# EAGLE design ESP32DevKitCv4_SA8x8_Ver_B (EAGLE 9.6.2)
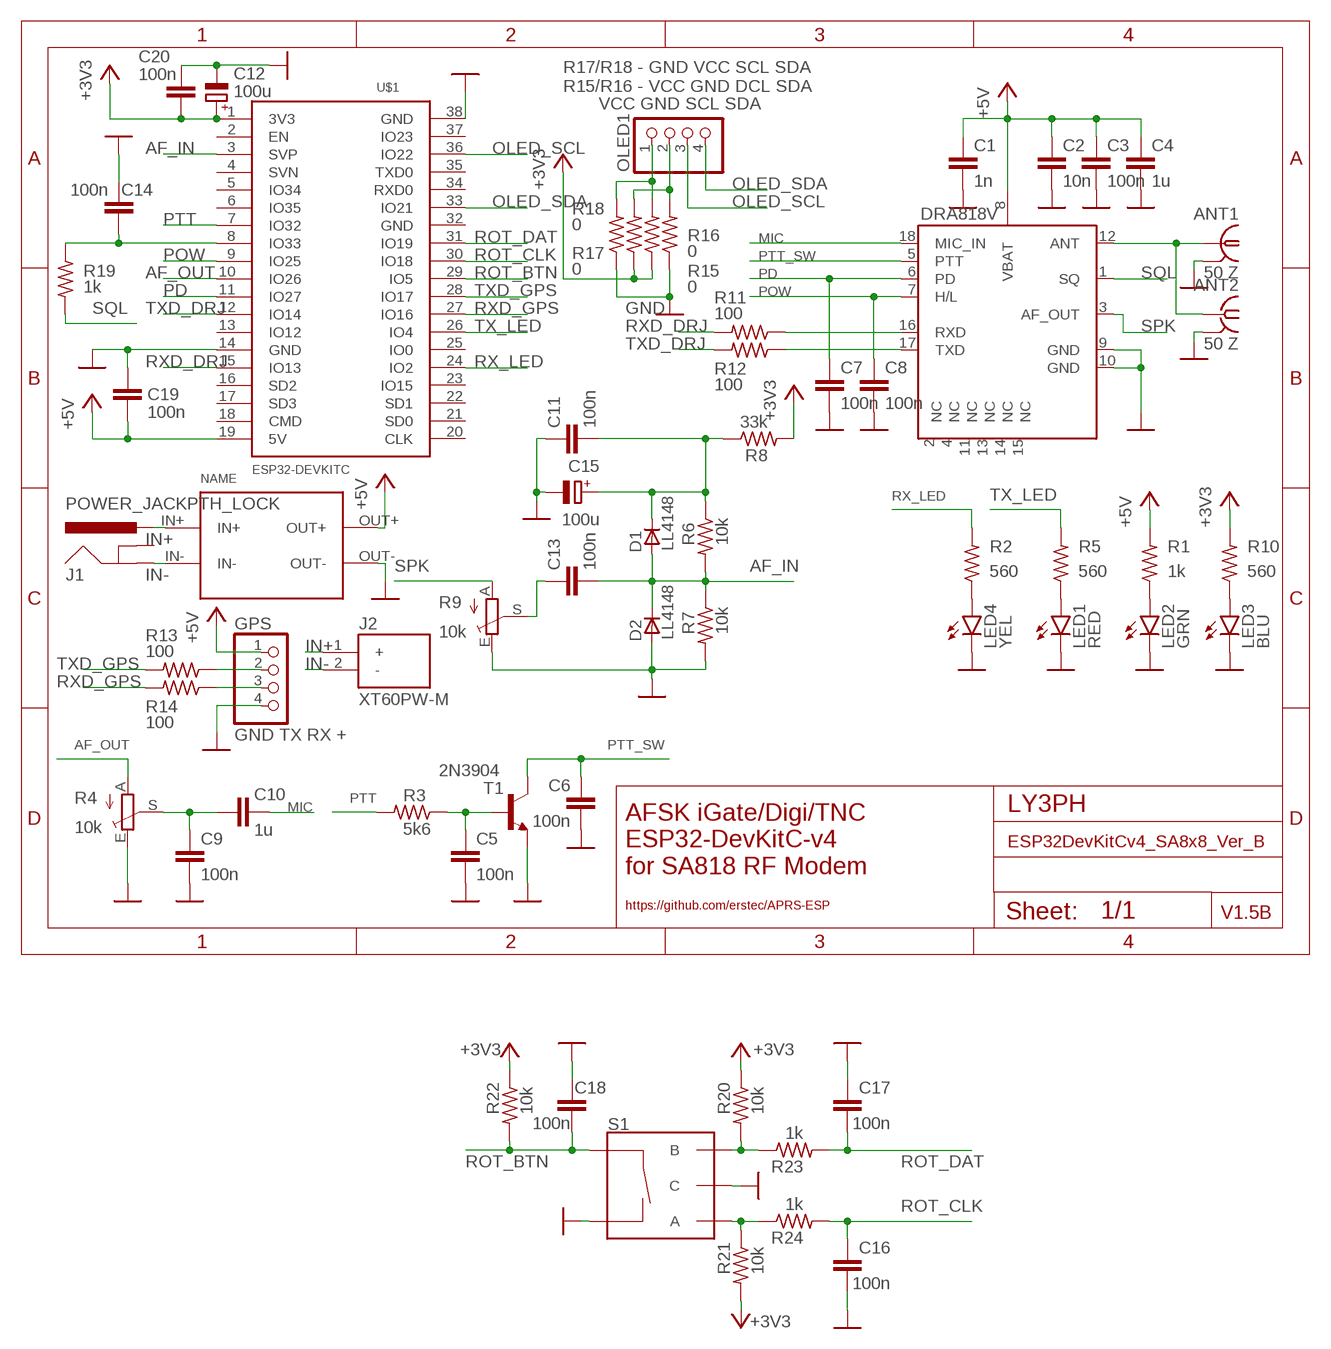
[diagram p0: schematic, sheet 1]

## Parts
ANT1  50 Z  LTI-SASF54GT  [LTI-SASF54GT]
ANT2  50 Z  SMA-142-0701-801/806  [J502-ND-142-0701-801/806]
C1  1n  C-EUC0805  [C0805]
C2  10n  C-EUC0805  [C0805]
C3  100n  C-EUC0805  [C0805]
C4  1u  C-EUC0805  [C0805]
C5  100n  C-EUC0805  [C0805]
C6  100n  C-EUC0805  [C0805]
C7  100n  C-EUC0805  [C0805]
C8  100n  C-EUC0805  [C0805]
C9  100n  C-EUC0805  [C0805]
C10  1u  C-EUC0805  [C0805]
C11  100n  C-EUC0805  [C0805]
C12  100u  CPOL-EUSMCD  [SMC_D]
C13  100n  C-EUC0805  [C0805]
C14  100n  C-EUC0805  [C0805]
C15  100u  CPOL-EUSMCD  [SMC_D]
C16  100n  C-EUC0805  [C0805]
C17  100n  C-EUC0805  [C0805]
C18  100n  C-EUC0805  [C0805]
C19  100n  C-EUC0805  [C0805]
C20  100n  C-EUC0805  [C0805]
D1  LL4148  [SOD80_DO213AA_MINIMELF]
D2  LL4148  [SOD80_DO213AA_MINIMELF]
DRA818V  DRA818A  [DRA818A]
GPS  GND TX RX +  PINHD-1X4  [1X04]
J1  POWER_JACKPTH_LOCK  [POWER_JACK_PTH_LOCK]
J2  XT60PW-M  [AMASS_XT60PW-M]
LED1  RED  LEDCHIP-LED0805  [CHIP-LED0805]
LED2  GRN  LEDCHIP-LED0805  [CHIP-LED0805]
LED3  BLU  LEDCHIP-LED0805  [CHIP-LED0805]
LED4  YEL  LEDCHIP-LED0805  [CHIP-LED0805]
OLED1  VCC GND SCL SDA  PINHD-1X4  [1X04]
R1  1k  R-US_R0805  [R0805]
R2  560  R-US_R0805  [R0805]
R3  5k6  R-US_R0805  [R0805]
R4  10k  TRIM_EU-CA6H  [CA6H]
R5  560  R-US_R0805  [R0805]
R6  10k  R-US_R0805  [R0805]
R7  10k  R-US_R0805  [R0805]
R8  33k  R-US_R0805  [R0805]
R9  10k  TRIM_EU-CA6H  [CA6H]
R10  560  R-US_R0805  [R0805]
R11  100  R-US_R0805  [R0805]
R12  100  R-US_R0805  [R0805]
R13  100  R-US_R0805  [R0805]
R14  100  R-US_R0805  [R0805]
R15  0  R-US_R0805  [R0805]
R16  0  R-US_R0805  [R0805]
R17  0  R-US_R0805  [R0805]
R18  0  R-US_R0805  [R0805]
R19  1k  R-US_R0805  [R0805]
R20  10k  R-US_R0805  [R0805]
R21  10k  R-US_R0805  [R0805]
R22  10k  R-US_R0805  [R0805]
R23  1k  R-US_R0805  [R0805]
R24  1k  R-US_R0805  [R0805]
S1  ENCODER-SWITCH  [ROTARY_ENC_PLAIN]
T1  2N3904  MMBT3904LT1-NPN-SOT23-BEC  [SOT23-BEC]
U$1  ESP32DEVKITC  [ESP32-DEVKITC]
U$2  CP8-ADJ  [CP8-ADJ]

## Nets
+3V3: C12.+ C20.2 R8.2 R10.2 R15.1 R17.1 R20.1 R21.2 R22.1 U$1.1(3V3)
+5V: C1.1 C2.1 C3.1 C4.1 C19.2 DRA818V.8(VBAT) GPS.1 R1.2 U$1.19(5V) U$2.OUT+
AF_IN: C13.2 D1.A D2.C R6.2 R7.1 U$1.3(SVP)
AF_OUT: R4.A U$1.10(IO26)
GND: ANT1.2 ANT1.3 ANT1.4 ANT1.5 ANT2.G@1 ANT2.G@2 ANT2.G@3 ANT2.G@4 C1.2 C2.2 C3.2 C4.2 C5.2 C6.2 C7.2 C8.2 C9.2 C11.1 C12.- C14.2 C15.- C16.2 C17.1 C18.1 C19.1 C20.1 D2.A DRA818V.9(GND) DRA818V.10(GND) GPS.4 LED1.C LED2.C LED3.C LED4.C R4.E R7.2 R9.E R16.1 R18.1 S1.C S1.SW- T1.E U$1.14(GND) U$1.38(GND) U$2.OUT-
IN+: J1.PWR J2.1(+) U$2.IN+
IN-: J1.GND J2.2(-) U$2.IN-
MIC: C10.2 DRA818V.18(MIC_IN)
N$1: LED1.A R5.1
N$2: C11.2 C15.+ D1.C R6.1 R8.1
N$3: GPS.2 R13.1
N$4: C13.1 R9.S
N$5: ANT1.1 ANT2.1 DRA818V.12(ANT)
N$7: C5.1 R3.1 T1.B
N$8: LED4.A R2.1
N$9: C9.1 C10.1 R4.S
N$12: LED3.A R10.1
N$13: GPS.3 R14.1
N$14: DRA818V.16(RXD) R11.1
N$15: DRA818V.17(TXD) R12.1
N$16: OLED1.2 R16.2 R17.2
N$17: OLED1.1 R15.2 R18.2
N$18: C14.1 R19.1 U$1.8(IO33)
N$41: LED2.A R1.1
OLED_SCL: OLED1.3 U$1.36(IO22)
OLED_SDA: OLED1.4 U$1.33(IO21)
PD: C7.1 DRA818V.6(PD) U$1.11(IO27)
POW: C8.1 DRA818V.7(H/L) U$1.9(IO25)
PTT: R3.2 U$1.7(IO32)
PTT_SW: C6.1 DRA818V.5(PTT) T1.C
ROT_BTN: C18.2 R22.2 S1.SW+ U$1.29(IO5)
ROT_CLK: C16.1 R24.2 U$1.30(IO18)
ROT_CLK_ROUTE: R21.1 R24.1 S1.A
ROT_DAT: C17.2 R23.2 U$1.31(IO19)
ROT_DAT_ROUTE: R20.2 R23.1 S1.B
RX_LED: R2.2 U$1.24(IO2)
RXD_DRJ: R11.2 U$1.15(IO13)
RXD_GPS: R14.2 U$1.27(IO16)
SPK: DRA818V.3(AF_OUT) R9.A
SQL: DRA818V.1(SQ) R19.2
TX_LED: R5.2 U$1.26(IO4)
TXD_DRJ: R12.2 U$1.12(IO14)
TXD_GPS: R13.2 U$1.28(IO17)
Unconnected: DRA818V.2(NC) DRA818V.4(NC) DRA818V.11(NC) DRA818V.13(NC) DRA818V.14(NC) DRA818V.15(NC) J1.GNDBREAK U$1.2(EN) U$1.4(SVN) U$1.5(IO34) U$1.6(IO35) U$1.13(IO12) U$1.16(SD2) U$1.17(SD3) U$1.18(CMD) U$1.20(CLK) U$1.21(SD0) U$1.22(SD1) U$1.23(IO15) U$1.25(IO0) U$1.32(GND) U$1.34(RXD0) U$1.35(TXD0) U$1.37(IO23)

## Notes on the sheet
- R17/R18 - GND VCC SCL SDA
  R15/R16 - VCC GND DCL SDA
- LY3PH
- AFSK iGate/Digi/TNC
  ESP32-DevKitC-v4
  for SA818 RF Modem
- https://github.com/erstec/APRS-ESP
- V1.5B

## Library data of the parts
ANT1 = con-coax:LTI-SASF54GT: SMA vertical PCB thrue hole jack Source: Lighthorse Technologies, inc. SASF54GT.pdf; OC_FARNELL: unknown; OC_NEWARK: unknown
ANT2 = con-coax:SMA-: SMA 50 Ohm End Launch Jack Receptacle - Round Contact Johnson Components Source: www.johnsoncomponents.com .. J502-ND.pdf; MF: JOHNSON COMPONENTS; MPN: 142-0701-801; OC_FARNELL: 1608592; OC_NEWARK: 90F2624
C1-C11 C13 C14 C16-C20 = resistor:C-EU: CAPACITOR, European symbol
C12 C15 = rcl:CPOL-EU: POLARIZED CAPACITOR, European symbol; SPICEPREFIX: C
D1 D2 = _hhn_diodes_smd:LL4148: 1N4148 General Purpose Rectifie SMD-Version of 1N4148 Case: SOD 80 = DO 213 AA = MINIMELF (Glass) Author: Dipl.-Ing. FH Rainer Bayer HHN Hochschule Heilbronn, rainer.bayer@hs-heilbronn.de Ingenieurbüro ing-rb, mail@ing-rb.de
DRA818V = dorji:DRA818A
GPS OLED1 = pinhead:PINHD-1X4: PIN HEADER
J1 = SparkFun-Connectors:POWER_JACK: Power Jack Connector This is the standard 5.5mm barrel jack for power. The PTH is the most common, proven, reliable, footprint. The Slot footprint only works if the mill layer is transmitted to the PCB fab house so be warned. Here are the connectors we sell at SparkFun: DC Barrel Power Jack/Connector <https://www.sparkfun.com/products/119> (PRT-00119) DC Barrel Power Jack/Connector (SMD) <https://www.sparkfun.com/products/12748> (PRT-12748) DC Barrel Jack Adapter - Breadboard Compatible <https://www.sparkfun.com/products/10811> (PRT-10811) It is used on this SparkFun product (and many, many others): SparkFun RedBoard - Programmed with Arduino <https://www.sparkfun.com/products/12757> (DEV-12757) Also, if you need a mating power supply or connector, please check these out: Wall Adapter Power Supply - 9VDC 650mA <https://www.sparkfun.com/products/298> (TOL-00298) DC Barrel Jack Adapter - Male <https://www.sparkfun.com/products/10287> (PRT-10287); PROD_ID: CONN-08197; SF_ID: PRT-00119
J2 = XT60PW-M:XT60PW-M: Check availability <https://pricing.snapeda.com/parts/XT60PW-M/AMASS/view-part?ref=eda>; AVAILABILITY: Not in stock; DESCRIPTION: Socket, DC supply, male, PIN: 2; MF: AMASS; MP: XT60PW-M; PACKAGE: Package; PRICE: None
LED1-LED4 = led:LED: LED OSRAM: - CHIPLED LG R971, LG N971, LY N971, LG Q971, LY Q971, LO R971, LY R971 LH N974, LH R974 LS Q976, LO Q976, LY Q976 LO Q996 - Hyper CHIPLED LW Q18S LB Q993, LB Q99A, LB R99A - SideLED LS A670, LO A670, LY A670, LG A670, LP A670 LB A673, LV A673, LT A673, LW A673 LH A674 LY A675 LS A676, LA A676, LO A676, LY A676, LW A676 LS A679, LY A679, LG A679 - Hyper Micro SIDELED® LS Y876, LA Y876, LO Y876, LY Y876 LT Y87S - SmartLED LW L88C, LW L88S LB L89C, LB L89S, LG L890 LS L89K, LO L89K, LY L89K LS L896, LA L896, LO L896, LY L896 - TOPLED LS T670, LO T670, LY T670, LG T670, LP T670 LSG T670, LSP T670, LSY T670, LOP T670, LYG T670 LG T671, LOG T671, LSG T671 LB T673, LV T673, LT T673, LW T673 LH T674 LS T676, LA T676, LO T676, LY T676, LB T676, LH T676, LSB T676, LW T676 LB T67C, LV T67C, LT T67C, LS T67K, LO T67K, LY T67K, LW E67C LS E67B, LA E67B, LO E67B, LY E67B, LB E67C, LV E67C, LT E67C LW T67C LS T679, LY T679, LG T679 LS T770, LO T770, LY T770, LG T770, LP T770 LB T773, LV T773, LT T773, LW T773 LH T774 LS E675, LA E675, LY E675, LS T675 LS T776, LA T776, LO T776, LY T776, LB T776 LHGB T686 LT T68C, LB T68C - Hyper Mini TOPLED® LB M676 - Mini TOPLED Santana® LG M470 LS M47K, LO M47K, LY M47K Source: http://www.osram.convergy.de LUXEON: - LUMILED® LXK2-PW12-R00, LXK2-PW12-S00, LXK2-PW14-U00, LXK2-PW14-V00 LXK2-PM12-R00, LXK2-PM12-S00, LXK2-PM14-U00 LXK2-PE12-Q00, LXK2-PE12-R00, LXK2-PE12-S00, LXK2-PE14-T00, LXK2-PE14-U00 LXK2-PB12-K00, LXK2-PB12-L00, LXK2-PB12-M00, LXK2-PB14-N00, LXK2-PB14-P00, LXK2-PB14-Q00 LXK2-PR12-L00, LXK2-PR12-M00, LXK2-PR14-Q00, LXK2-PR14-R00 LXK2-PD12-Q00, LXK2-PD12-R00, LXK2-PD12-S00 LXK2-PH12-R00, LXK2-PH12-S00 LXK2-PL12-P00, LXK2-PL12-Q00, LXK2-PL12-R00 Source: www.luxeon.com KINGBRIGHT: KA-3528ASYC Source: www.kingbright.com
R1-R3 R5-R8 R10-R24 = resistor:R-US_: RESISTOR, American symbol
R4 R9 = pot:TRIM_EU-: POTENTIOMETER
S1 = SparkFun-Switches:ENCODER-SWITCH: Rotary Encoder w/ Select Switch Encoders rotate similarly to potentiometers, but they’re different from potentiometers in that an encoder has full rotation without limits. They output gray code so that you can tell how much and in which direction the encoder has been turned. This encoder includes a push-down select switch built into the shaft. SparkFun Products Rotary Encoder <https://www.sparkfun.com/products/9117> (COM-09117); SF_SKU: COM-09117
T1 = transistor:*-NPN-: NPN Transistror BF959 corrected 2008.03.06
U$1 = ESP32-DEVKITC:ESP32DEVKITC
U$2 = userlib:CP8-ADJ: Voltage regulator IN: 7-35V OUT: ADJ

## Board
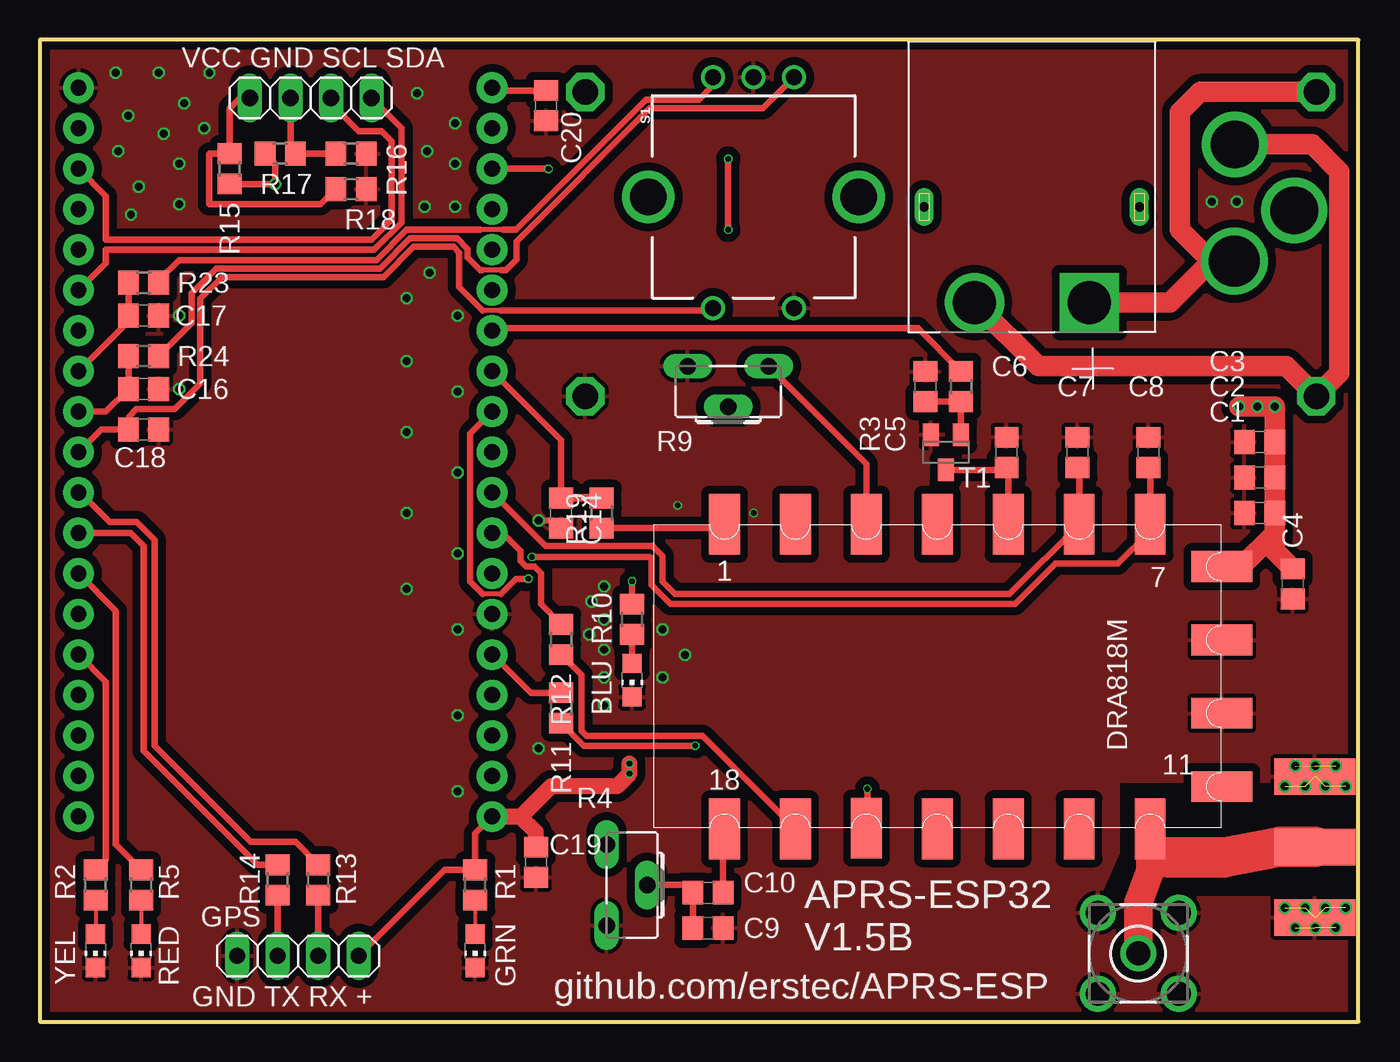
[diagram p1: board, top side]
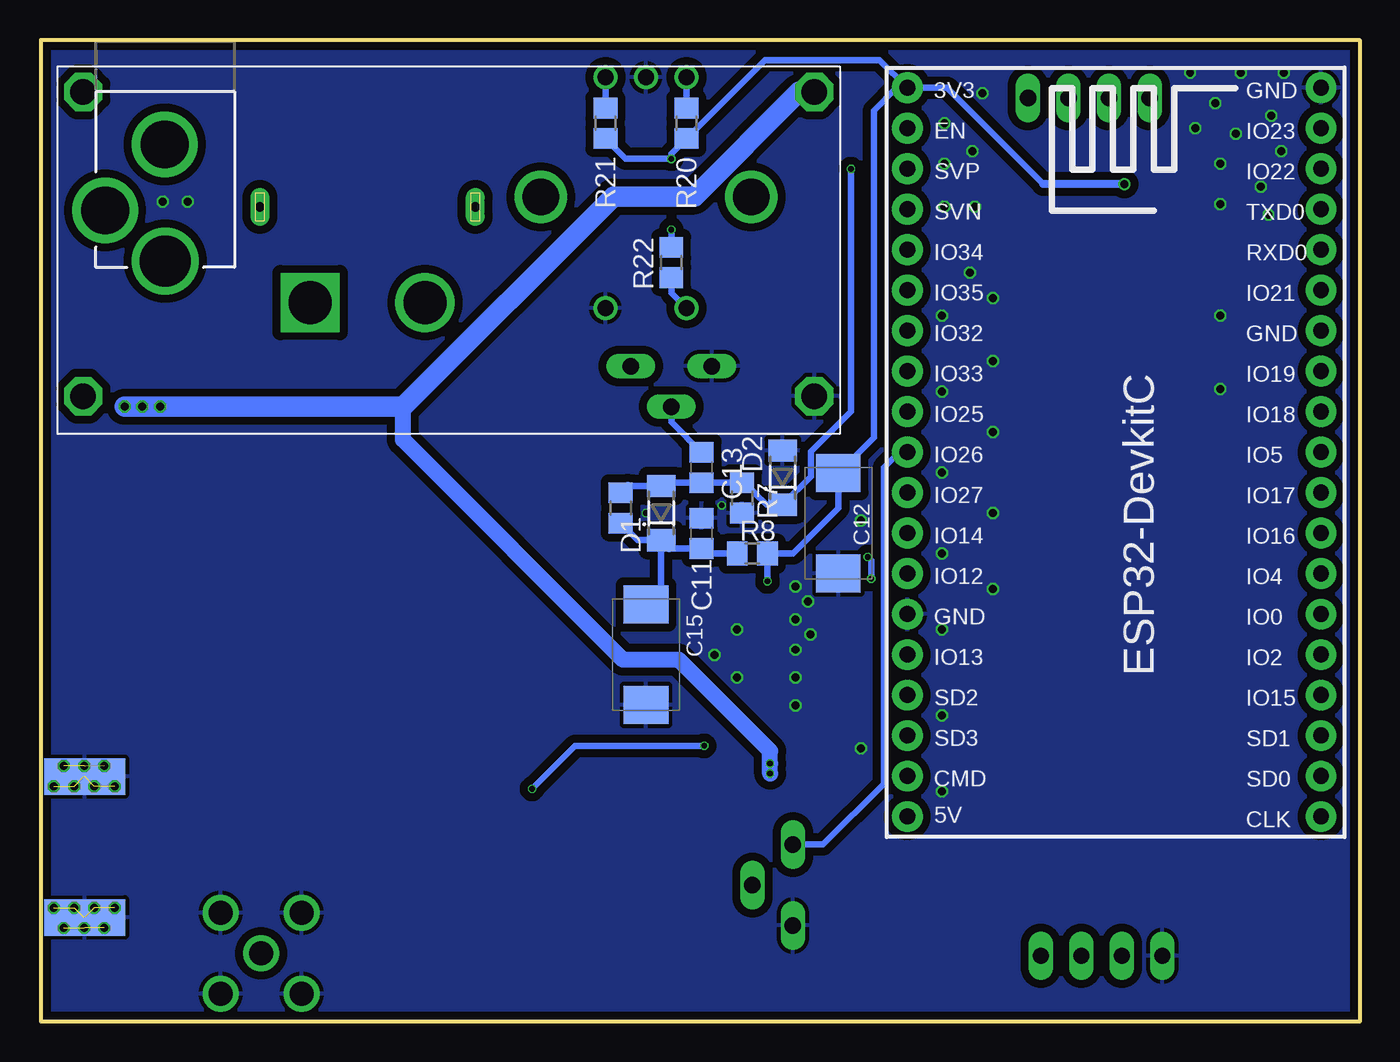
[diagram p2: board, bottom side, seen from below]

Size 82.71 x 61.59 mm. Coordinates in mm from the lower left corner, seen from the top.
Outline: 0,61.6 0,0 82.71,0 82.71,61.6 0,61.6
Copper layers (1*16): Top 0.035559375mm / dielectric 1.6mm / Bottom 0.035559375mm
Design rules "jlcpcb-2layers *": minimum track width 5mil, minimum drill 12mil, track to track 5mil, track to pad 5mil, pad to pad 5mil, via to via 5mil, smd to smd 5mil, copper to edge 8mil, drill to drill 6mil, minimum pad ring 5mil, minimum via ring 3mil, stop-mask expansion 2.5mil, vias tented up to drill 100mil, thermal gap 10mil

### Footprints (pad centres in the part's own frame; a part is rotated, then mirrored left to right if it is on the bottom)
LTI-SASF54GT = drill 1.5 pad 2.2: 1 0,0; 2 -2.54,2.54; 3 2.54,2.54; 4 2.54,-2.54; 5 -2.54,-2.54
J502-ND-142-0701-801/806 = smd 5.08 x 2.286: 1 2.565,0; G@1 2.565,4.42; G@2 2.565,-4.42 | smd 5.08 x 2.286 bottom: G@3 2.565,4.42; G@4 2.565,-4.42
C0805 = smd 1.3 x 1.5: 1 -0.95,0; 2 0.95,0
SMC_D = smd 2.4 x 2.8: + -3.15,0; - 3.15,0
SOD80_DO213AA_MINIMELF = smd 1.4 x 1.8: A 1.7,0; C -1.7,0
DRA818A = smd 3.81 x 1.93: 1 -9.45,-13.25; 2 -9.45,-8.8; 3 -9.45,-4.35; 4 -9.45,0.1; 5 -9.45,4.55; 6 -9.45,9; 7 -9.45,13.45; 12 9.65,13.45; 13 9.65,9; 14 9.65,4.55; 15 9.65,0.1; 16 9.6,-4.35; 17 9.65,-8.8; 18 9.65,-13.25 | smd 1.93 x 3.81: 8 -6.8,17.95; 9 -2.2,17.95; 10 2.4,17.95; 11 7,17.95
1X04 = drill 1.016 long: 1 -3.81,0; 2 -1.27,0; 3 1.27,0; 4 3.81,0
POWER_JACK_PTH_LOCK = drill 2.997 pad 4.115: GND 0.025,6.557; GNDBREAK 3.762,10.7 | drill 3.2 pad 4.115: PWR 0,13.878
AMASS_XT60PW-M = drill 2.7 square: 1 3.6,-6 | drill 2.7: 2 -3.6,-6 | drill 0.6 pad 1.2 long: S1 6.75,0; S2 -6.75,0
CHIP-LED0805 = smd 1.2 x 1.2: A 0,-1.05; C 0,1.05
R0805 = smd 1.3 x 1.5: 1 -0.95,0; 2 0.95,0
CA6H = drill 1.016 long: A -2.54,0; E 2.54,0; S 0,2.54
ROTARY_ENC_PLAIN = drill 1.016: A 7.493,-2.54; B 7.493,2.54; C 7.493,0; SW+ -6.985,2.54; SW- -6.985,-2.54 | drill 2.286: P$3 0,6.604; P$4 0,-6.604
SOT23-BEC = smd 1 x 1.4: B -0.95,-1.1; C 0,1.1; E 0.95,-1.1
ESP32-DEVKITC = drill 1 pad 1.93: 1 -22.87,-14.722; 2 -20.33,-14.722; 3 -17.79,-14.722; 4 -15.25,-14.722; 5 -12.71,-14.722; 6 -10.17,-14.722; 7 -7.63,-14.722; 8 -5.09,-14.722; 9 -2.55,-14.722; 10 -0.01,-14.722; 11 2.53,-14.722; 12 5.07,-14.722; 13 7.61,-14.722; 14 10.15,-14.722; 15 12.69,-14.722; 16 15.23,-14.722; 17 17.77,-14.722; 18 20.31,-14.722; 19 22.85,-14.722; 20 22.85,11.23; 21 20.31,11.23; 22 17.77,11.23; 23 15.23,11.23; 24 12.69,11.23; 25 10.15,11.23; 26 7.61,11.23; 27 5.07,11.23; 28 2.53,11.23; 29 -0.01,11.23; 30 -2.55,11.23; 31 -5.09,11.23; 32 -7.63,11.23; 33 -10.17,11.23; 34 -12.71,11.23; 35 -15.25,11.23; 36 -17.79,11.23; 37 -20.33,11.23; 38 -22.87,11.23
CP8-ADJ = drill 1.6 octagon: IN+ -21.81,7.05; IN- -21.81,-12.036; OUT+ 24.054,7.05; OUT- 24.054,-12.036

### Placement (x,y rotation side)
ANT1  68.9,4.29 0 top
ANT2  82.55,10.95 180 top
C1  76.52,31.91 180 top
C2  76.52,34.13 180 top
C3  76.52,36.35 180 top
C4  78.58,27.46 270 top
C5  55.56,39.85 90 top
C6  60.64,35.72 90 top
C7  65.09,35.72 90 top
C8  69.53,35.72 90 top
C9  41.91,5.87 0 top
C10  41.91,8.1 0 top
C11  41.27,30.64 270 bottom
C12  32.7,31.27 270 bottom
C13  41.27,34.77 270 bottom
C14  32.7,31.91 270 top
C15  44.77,23.02 270 bottom
C16  6.51,39.69 0 top
C17  6.51,44.29 180 top
C18  6.51,37.15 180 top
C19  31.12,10 90 top
C20  31.75,57.47 90 top
D1  43.81,31.91 90 bottom
D2  36.2,34.13 90 bottom
DRA818V  56.2,21.75 270 top
GPS  16.19,4.13 180 top
J1  74.93,61.59 180 bottom
J2  62.23,51.12 0 top
LED1  6.35,4.44 180 top
LED2  27.3,4.44 180 top
LED3  37.15,21.43 180 top
LED4  3.49,4.44 180 top
OLED1  16.99,57.94 0 top
R1  27.3,8.57 90 top
R2  3.49,8.57 90 top
R3  57.78,39.85 90 top
R4  35.56,8.57 270 top
R5  6.35,8.57 90 top
R6  46.35,32.23 90 bottom
R7  38.73,32.86 270 bottom
R8  38.1,29.37 0 bottom
R9  43.18,41.12 180 top
R10  37.15,25.24 90 top
R11  32.7,19.68 90 top
R12  32.7,23.97 90 top
R13  17.46,8.89 90 top
R14  14.92,8.89 90 top
R15  11.91,53.5 90 top
R16  19.53,54.45 180 top
R17  15.08,54.45 0 top
R18  19.53,52.23 180 top
R19  35.24,31.91 270 top
R20  42.23,56.36 90 bottom
R21  47.31,56.36 270 bottom
R22  43.18,47.62 270 bottom
R23  6.51,46.36 180 top
R24  6.51,41.75 180 top
S1  44.77,51.75 90 top
T1  56.83,35.72 180 top
U$1  13.65,35.72 270 bottom
U$2  58.26,51.28 0 bottom

### Tracks (layer width: path | path; a pad name or v marks a point on that pad's centre or on a via)
+3V3  (via drill 0.35, 0.51)
  Top 0.406: R17.1 14.76,53.82 v14.76,52.55 | R15.1 v14.76,52.55 | R10.2 v37.15,27.62 | v43.18,49.69 v43.18,54.13 | C20.2 28.55,58.42 U$1.1
  Top 0.508: R10.2 | v14.76,52.55
  Bottom 0.406: v37.15,27.62 R8.2 35.56,29.37 32.7,32.23 C12.+ 30.48,36.65 30.48,57.15 29.04,58.59 U$1.1 | R22.1 v43.18,49.69 | R21.2 46.03,54.13 v43.18,54.13 43.18,54.45 R20.1 37.31,60.33 30.11,60.33 U$1.1 | U$1.1 25.89,58.59 19.84,52.55
  Bottom 0.508: v14.76,52.55 19.84,52.55
+5V  (via drill 0.35, 0.5)
  Top 0.406: U$1.19 27.3,11.8 R1.2 25.4,9.52 GPS.1
  Top 1.016: 30.16,12.86 32.07,14.76 36.2,14.76 v36.99,15.56 v36.99,16.19 | 30.16,12.86 28.38,12.86 U$1.19 | C19.2 31.12,11.91 30.16,12.86
  Top 1.27: 77.47,30.64 C1.1 C2.1 C3.1 v77.47,38.58 v76.36,38.58 v75.25,38.58 | 77.47,30.64 75.38,28.55 DRA818V.8 | C4.1 77.47,29.53 77.47,30.64
  Bottom 1.016: v36.99,15.56 v36.99,16.19 36.99,16.99 42.7,22.7 46.2,22.7 60.01,36.51 60.01,38.58
  Bottom 1.27: v77.47,38.58 60.01,38.58 46.81,51.77 41.73,51.77 35.18,58.33 U$2.OUT+
AF_IN  (via drill 0.35)
  Top 0.406: v31.91,53.5 28.38,53.5 U$1.3
  Bottom 0.406: C13.2 R7.1 38.58,33.81 37.94,33.18 37.95,33.18 37.21,32.43 D2.C 34.43,34.19 34.43,35.76 31.91,38.28 v31.91,53.5 | C13.2 43.61,33.82 | D1.A 45.92,33.61
  Bottom 0.508: C13.2 | 43.61,33.82 D1.A | 45.92,33.61 R6.2
AF_OUT
  Bottom 0.406: R4.A 33.65,11.11 29.85,14.92 29.85,34.77 28.88,35.73 U$1.10
GND  (via drill 0.35, 0.5 pad 0.61)  (12 unrouted)
  Top 0.406: v31.27,31.43 32.23,31.43 C14.2
  Top 0.508: 79.98,16.01 v80.01,16.03 | ANT2.G@4 80.04,15.37 | 79.98,5.9 v80.01,5.87 | ANT2.G@3 80.04,6.53
  other vias: 78.74,16.03 81.28,16.03 78.11,14.76 79.38,14.76 80.65,14.76 78.11,7.14 78.74,5.87 79.38,7.14 80.65,7.14 81.28,5.87 81.92,7.14 81.92,14.76 7.46,59.53 10.64,59.53 9.05,57.63 7.78,55.72 10.32,56.04 8.73,53.82 8.73,51.28 24.45,46.99 23.02,45.4 26.19,14.45 26.19,24.61 26.19,34.45 26.19,44.29 26.19,39.53 26.19,29.37 26.19,19.21 24.13,51.12 24.29,54.61 23.65,58.26 23.02,27.15 23.02,31.91 23.02,36.99 23.02,41.43 4.76,59.53 5.56,56.83 6.19,52.39 44.77,31.91 40,32.39 8.73,39.69 35.4,27.3 34.61,26.35 35.4,25.24 34.45,24.29 35.4,23.34 35.4,21.59 35.4,19.84 39.05,21.59 39.05,24.61 40.48,23.02 8.73,44.29 31.27,17.14 75.09,51.44 73.5,51.44 4.92,54.61 5.71,50.64 26.04,56.36 26.04,51.12 26.04,53.82
  pour Bottom (isolate 0.5): 0,0 0,61.59 82.71,61.59 82.71,0
  pour Top (isolate 0.5): 0,0 0,61.59 82.71,61.59 82.71,15.08 67.63,15.08 67.63,10.64 66.36,7.78 82.71,7.78 82.71,0
IN+
  Top 1.27: U$2.IN+ 80.06,58.34 72.79,58.34 71.52,57.07 71.52,49.69 73.49,47.72 | 73.49,47.72 J1.PWR | J2.1 70.89,45.12 73.49,47.72
IN-
  Top 1.27: J1.GND 79.82,55.04 81.52,53.34 81.52,40.69 U$2.IN- 78.2,41.12 62.63,41.12 J2.2
MIC
  Top 0.406: C10.2 42.86,12.01 DRA818V.18
N$1
  Top 0.254: R5.1 LED1.A
N$2
  Bottom 0.406: R6.1 45.29,30.21 D1.C 43.82,27.12 C15.+ | 43.29,29.69 C11.2 | 40.95,29.37 R8.1
  Bottom 0.508: D1.C 43.29,29.69 | C11.2 40.95,29.37
N$3
  Top 0.406: GPS.2 R13.1
N$4
  Bottom 0.406: R9.S 43.18,37.62 C13.1
N$5
  Top 1.778: ANT1.1 68.9,7.46 69.65,9.48 DRA818V.12 69.65,10.52 69.85,10.32 70.8,10.32
  Top 2.54: 70.8,10.32 74.29,10.32 77.79,10.95 ANT2.1
N$7
  Top 0.406: T1.B R3.1 C5.1
N$8
  Top 0.254: R2.1 LED4.A
N$9
  Top 0.406: C9.1 C10.1 40.48,8.57 R4.S
N$12
  Top 0.406: R10.1 LED3.A
N$13
  Top 0.406: R14.1 GPS.3
N$14  (via drill 0.35)
  Top 0.406: R11.1 34.13,17.3 v41.12,17.3 | v51.91,14.61 51.91,12.21 DRA818V.16
  Bottom 0.406: v51.91,14.61 49.21,17.3 v41.12,17.3
N$15
  Top 0.406: DRA818V.17 41.56,17.94 34.29,17.94 33.97,18.26 33.97,21.75 R12.1
N$16
  Top 0.406: R16.2 R17.2 | OLED1.2 15.72,54.77
  Top 0.508: 15.72,54.77 R17.2
N$17
  Top 0.406: R18.2 17.62,51.28 10.64,51.28 10.64,54.45 R15.2 | R15.2 11.91,57.3 12.86,58.26
  Top 0.508: 12.86,58.26 OLED1.1 | R15.2
N$18
  Top 0.406: U$1.8 32.7,36.48 C14.1
  Top 0.508: R19.1 C14.1
N$41
  Top 0.254: R1.1 LED2.A
OLED_SCL
  Top 0.406: OLED1.3 18.26,57.63 20,55.88 21.43,55.88 22.07,55.25 22.07,50.32 20.8,49.05 4.13,49.05 4.13,51.8 U$1.36
OLED_SDA
  Top 0.406: OLED1.4 22.68,56.06 22.68,50.13 20.97,48.42 4.13,48.42 4.13,47.59 U$1.33
PD
  Top 0.406: C7.1 65.2,34.66 DRA818V.6 60.83,26.83 39.85,26.83 39.05,27.62 39.05,29.21 38.42,29.85 31.72,29.85 U$1.11
POW  (via drill 0.35)
  Top 0.305: 28.94,26.84 28.93,26.83 27.78,26.83
  Top 0.406: C8.1 69.65,34.65 DRA818V.7 69.65,30.75 67.63,28.73 63.69,28.73 61.15,26.19 39.57,26.19 38.36,27.4 38.36,29.05 38.26,29.15 v30.85,29.15 | v30.64,27.78 29.88,27.78 28.94,26.84 | 27.78,26.83 26.99,27.62 26.99,36.88 U$1.9
  Bottom 0.406: v30.85,29.15 30.64,28.94 v30.64,27.78
PTT
  Top 0.406: R3.2 55.08,43.5 28.52,43.5 U$1.7
PTT_SW
  Top 0.406: T1.C 60.49,34.62 C6.1 60.75,34.66 DRA818V.5
ROT_BTN
  Top 0.305: 28.94,44.62 27.79,44.62 27.78,44.61
  Top 0.406: S1.SW+ 42.07,44.61 28.95,44.61 28.94,44.62 | 27.78,44.61 26.3,46.09 26.3,48.26 25.94,48.62 23.46,48.62 21.56,46.72 11.43,46.72 10.07,45.36 10.07,40.03 8.46,38.42 6.03,38.42 5.59,37.98 5.59,37.15 C18.2 3.84,37.15 U$1.29
  Bottom 0.406: R22.2 43.18,45.72 S1.SW+
ROT_CLK
  Top 0.406: U$1.30 4.14,38.27 C16.1 R24.2
ROT_CLK_ROUTE
  Top 0.305: 28.94,47.16 27.79,47.16 27.78,47.15
  Top 0.406: S1.A 45.37,57.31 38.26,57.31 29.89,48.94 29.89,47.79 29.25,47.16 28.94,47.16 | 27.78,47.15 27.62,47.15 26.83,47.94 26.83,48.48 26.16,49.15 23.24,49.15 21.33,47.25 11.06,47.25 9.52,45.72 9.52,43.82 R24.1
  Bottom 0.406: S1.A R21.1
ROT_DAT
  Top 0.406: U$1.31 5.56,43.95 C17.2 R23.2
ROT_DAT_ROUTE
  Top 0.305: 29.05,49.69 27.62,49.69
  Top 0.406: S1.B 42.23,58.74 41.33,57.84 38.04,57.84 29.88,49.69 29.05,49.69 | 27.62,49.69 23.02,49.69 21.11,47.78 8.73,47.78 7.46,46.51 R23.1
  Bottom 0.406: S1.B R20.2
RX_LED
  Top 0.406: U$1.24 4.13,21.32 4.13,10.16 R2.2
RXD_DRJ
  Top 0.406: U$1.15 28.41,23.03 30.8,20.64 R11.2
RXD_GPS
  Top 0.406: R14.2 13.65,9.84 6.51,16.98 6.51,29.85 5.7,30.65 U$1.27
SPK
  Top 0.406: DRA818V.3 51.85,34.99 R9.A
SQL
  Top 0.406: R19.2 42.71,30.96
  Top 0.508: 42.71,30.96 DRA818V.1
TX_LED
  Top 0.406: R5.2 4.76,11.11 4.76,25.77 U$1.26
TXD_DRJ
  Top 0.406: U$1.12 29.01,30.65 29.05,30.64 30.16,29.53 30.16,28.89 30.51,28.54 31.03,28.54 31.43,28.14 31.43,26.19 R12.2
TXD_GPS
  Top 0.406: R13.2 16.03,11.27 13.23,11.27 7.2,17.3 7.2,30.22 6.08,31.34 4.38,31.34 2.53,33.19 U$1.28

### Text on the board
tNames: APRS-ESP32 / V1.5B | github.com/erstec/APRS-ESP